# EAGLE schematic USB-RS232 Adapter FT232RL (EAGLE 4.16)
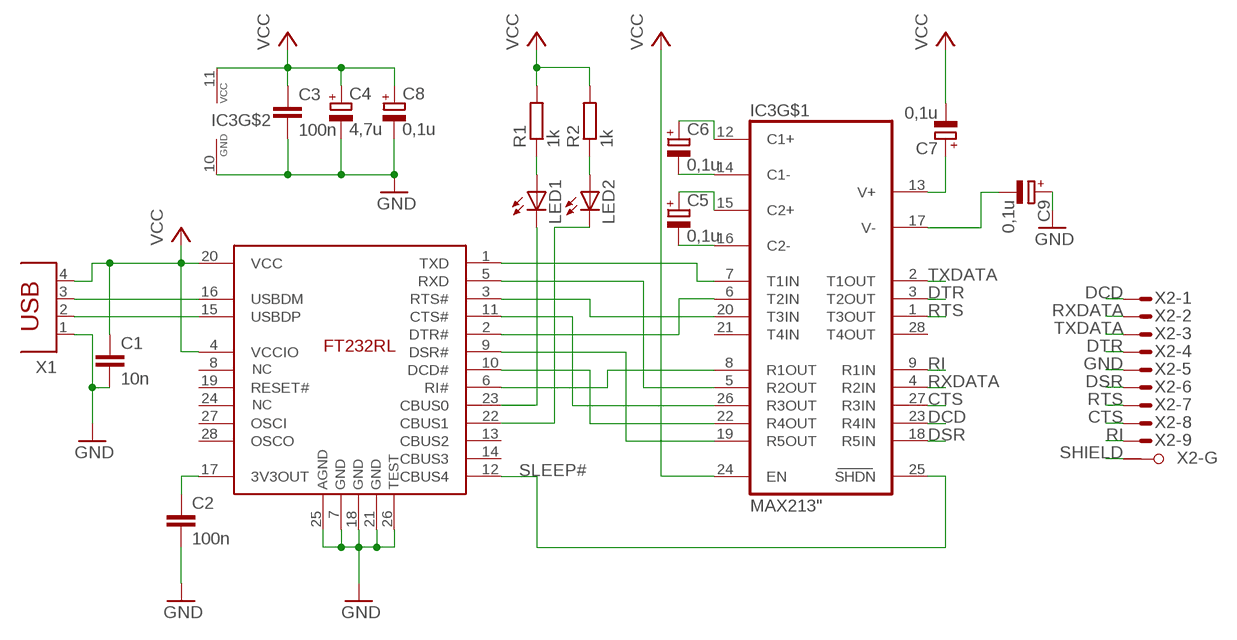
[diagram p0: schematic, sheet 1]

## Parts
C1  10n  C-EUC1206  [C1206]
C2  100n  C-EUC1206  [C1206]
C3  100n  C-EUC1206  [C1206]
C4  4,7u  CPOL-EUSMCD  [SMC_D]
C5  0,1u  CPOL-EUSMCA  [SMC_A]
C6  0,1u  CPOL-EUSMCA  [SMC_A]
C7  0,1u  CPOL-EUSMCA  [SMC_A]
C8  0,1u  CPOL-EUSMCA  [SMC_A]
C9  0,1u  CPOL-EUSMCA  [SMC_A]
IC1  FT232R  [SSOP28]
IC3  MAX213"  [SSOP28]
LED1  LED3MM  [LED3MM]
LED2  LED3MM  [LED3MM]
R1  1k  R-EU_M1206  [M1206]
R2  1k  R-EU_M1206  [M1206]
X1  PN87520  [PN87520]
X2  M09HPS  [M09HP]

## Nets
CTS: IC3.27(R3IN) X2.8(-8:M)
CTS#: IC1.11(CTS#) IC3.26(R3OUT)
DCD: IC3.23(R4IN) X2.1(-1:M)
DCD#: IC1.10(DCD#) IC3.22(R4OUT)
DSR: IC3.18(R5IN) X2.6(-6:M)
DSR#: IC1.9(DSR#) IC3.19(R5OUT)
DTR: IC3.3(T2OUT) X2.4(-4:M)
DTR#: IC1.2(DTR#) IC3.6(T2IN)
GND: C1.2 C2.2 C3.2 C4.- C8.- C9.+ IC1.7(GND1) IC1.18(GND2) IC1.21(GND3) IC1.25(AGND) IC1.26(TEST) IC3.10(GND) X1.1 X2.5(-5:M)
N$1: C2.1 IC1.17(3V3OUT)
N$2: IC1.16(USBDM) X1.3
N$3: IC1.15(USBDP) X1.2
N$4: C5.- IC3.16(C2-)
N$5: C5.+ IC3.15(C2+)
N$6: C6.- IC3.14(C1-)
N$7: C6.+ IC3.12(C1+)
N$10: C9.- IC3.17(V-)
N$12: C7.+ IC3.13(V+)
N$15: LED1.A R1.1
N$16: LED2.A R2.1
RI: IC3.9(R1IN) X2.9(-9:M)
RI#: IC1.6(RI#) IC3.8(R1OUT)
RTS: IC3.1(T3OUT) X2.7(-7:M)
RTS#: IC1.3(RTS#) IC3.20(T3IN)
RXD: IC1.5(RXD) IC3.5(R2OUT)
RXDATA: IC3.4(R2IN) X2.2(-2:M)
RXDLED: IC1.22(CBUS1) LED2.K(C)
SHIELD: X2.G1(-G:G1)
SLEEP#: IC1.12(CBUS4) IC3.25(SHDN)
TXD: IC1.1(TXD) IC3.7(T1IN)
TXDATA: IC3.2(T1OUT) X2.3(-3:M)
TXDLED: IC1.23(CBUS0) LED1.K(C)
VCC: C1.1 C3.1 C4.+ C7.- C8.+ IC1.4(VCCIO) IC1.20(VCC) IC3.11(VCC) IC3.24(EN) R1.2 R2.2 X1.4
Unconnected: IC1.8(NC1) IC1.13(CBUS2) IC1.14(CBUS3) IC1.19(RESET#) IC1.24(NC2) IC1.27(OSCI) IC1.28(OSCO) IC3.21(T4IN) IC3.28(T4OUT) X2.G2(-G:G2)

## Library data of the parts
C1-C3 = rcl:C-EU: CAPACITOR, European symbol
C4-C9 = rcl:CPOL-EU: POLARIZED CAPACITOR, European symbol
IC1 = ftdichip:FT232R: FT232RL der Firma FTDIchip.com USB Seriell Converter. Ideal um einen RS232 Anschluss für den Laptop bereitzustellen. unter www.wsgs.net gibt es auch ein Eagle Board dazu.
IC3 = maxim:MAX213*
LED1 LED2 = led:LED: LED OSRAM: - CHIPLED LG R971, LG N971, LY N971, LG Q971, LY Q971, LO R971, LY R971 LH N974, LH R974 LS Q976, LO Q976, LY Q976 LO Q996 - Hyper CHIPLED LW Q18S LB Q993, LB Q99A, LB R99A - SideLED LS A670, LO A670, LY A670, LG A670, LP A670 LB A673, LV A673, LT A673, LW A673 LH A674 LY A675 LS A676, LA A676, LO A676, LY A676, LW A676 LS A679, LY A679, LG A679 - Hyper Micro SIDELED® LS Y876, LA Y876, LO Y876, LY Y876 LT Y87S - SmartLED LW L88C, LW L88S LB L89C, LB L89S, LG L890 LS L89K, LO L89K, LY L89K LS L896, LA L896, LO L896, LY L896 - TOPLED LS T670, LO T670, LY T670, LG T670, LP T670 LSG T670, LSP T670, LSY T670, LOP T670, LYG T670 LG T671, LOG T671, LSG T671 LB T673, LV T673, LT T673, LW T673 LH T674 LS T676, LA T676, LO T676, LY T676, LB T676, LH T676, LSB T676, LW T676 LB T67C, LV T67C, LT T67C, LS T67K, LO T67K, LY T67K, LW E67C LS E67B, LA E67B, LO E67B, LY E67B, LB E67C, LV E67C, LT E67C LW T67C LS T679, LY T679, LG T679 LS T770, LO T770, LY T770, LG T770, LP T770 LB T773, LV T773, LT T773, LW T773 LH T774 LS E675, LA E675, LY E675, LS T675 LS T776, LA T776, LO T776, LY T776, LB T776 LHGB T686 LT T68C, LB T68C - Hyper Mini TOPLED® LB M676 - Mini TOPLED Santana® LG M470 LS M47K, LO M47K, LY M47K Source: http://www.osram.convergy.de/
R1 R2 = rcl:R-EU_: RESISTOR, European symbol
X1 = con-berg:PN87520: BERG USB connector
X2 = con-subd:M09HPS: SUB-D